# Altium project ESP32-Pico-Pill.PrjPcb
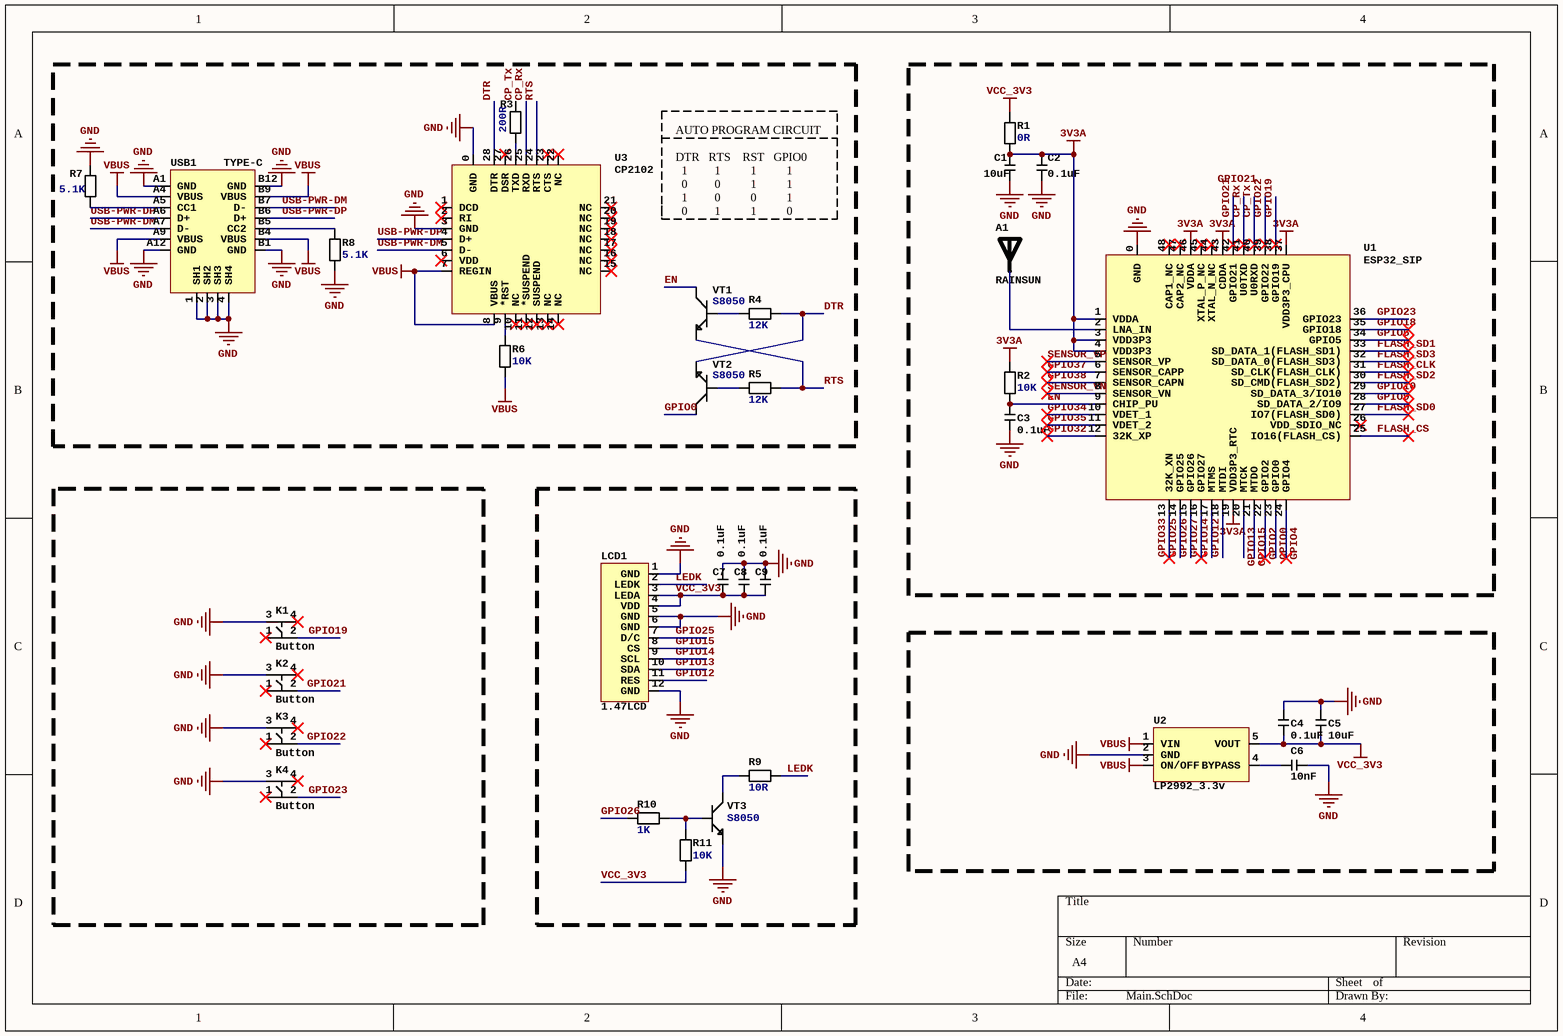
[diagram p0: Main.SchDoc]
1 sheet, 33 parts. Net scope: global (net labels, ports and power ports of the same name join across sheets).
Board file: ESP32-Pico-Pill.PcbDoc

## Sheet Main.SchDoc
size A4

### Parts
A1  RAINSUN  [ANT-Rainsun-AN5120]
C1  10uF  [CAP_0603]
C2  0.1uF  [CAP_0603]
C3  0.1uF  [CAP_0603]
C4  0.1uF  [CAP_0603]
C5  10uF  [CAP_0603]
C6  10nF  [CAP_0603]
C7  0.1uF  [CAP_0603]
C8  0.1uF  [CAP_0603]
C9  0.1uF  [CAP_0603]
K1  Button  [Button]
K2  Button  [Button]
K3  Button  [Button]
K4  Button  [Button]
LCD1  1.47LCD  [IPS130-12]
R1  0R  [RES_0603]
R2  10K  [RES_0603]
R3  200R  [RES_0603]
R4  12K  [RES_0603]
R5  12K  [RES_0603]
R6  10K  [RES_0603]
R7  5.1K  [RES_0603]
R8  5.1K  [RES_0603]
R9  10R  [RES_0603]
R10  1K  [RES_0603]
R11  10K  [RES_0603]
U1  ESP32_SIP  [ESP32-Pico]
U2  LP2992_3.3v  [LP2992]
U3  CP2102  [CP2102]
USB1  TYPE-C  [TYPE-C]
VT1  S8050  [s8050]
VT2  S8050  [s8050]
VT3  S8050  [s8050]

### Nets
3V3A: C1.2 C2.2 R1.1 R2.2 U1.1(VDDA) U1.3(VDD3P3) U1.4(VDD3P3) U1.19(VDD3P3_RTC) U1.37(VDD3P3_CPU) U1.43(CDDA) U1.46(VDDA)
GND: C1.1 C2.1 C3.1 C4.2 C5.2 C6.2 C7.2 C8.2 C9.2 K1.3 K2.3 K3.3 K4.3 LCD1.1(GND) LCD1.5(GND) LCD1.6(GND) LCD1.12(GND) R7.2 R8.1 U1.0(GND) U2.2(GND) U3.0(GND) U3.3(GND) USB1.1(SH1) USB1.2(SH2) USB1.3(SH3) USB1.4(SH4) USB1.A1(GND) USB1.A12(GND) USB1.B1(GND) USB1.B12(GND) VT3.2(E)
VBUS: R6.1 U2.1(VIN) U2.3(ON/OFF) U3.7(REGIN) U3.8(VBUS) USB1.A4(VBUS) USB1.A9(VBUS) USB1.B4(VBUS) USB1.B9(VBUS)
VCC_3V3: C4.1 C5.1 C7.1 C8.1 C9.1 LCD1.3(LEDA) LCD1.4(VDD) R1.2 R11.1 U2.5(VOUT)
CP_Rx: U1.41(U0TXD) U3.25(RXD)
CP_Tx: R3.2 U1.40(U0RXD)
DTR: R4.2 U3.28(DTR) VT2.2(E)
EN: C3.2 R2.1 U1.9(CHIP_PU) VT1.1(C)
FLASH_CLK: U1.31(SD_CLK(FLASH_CLK))
FLASH_CS: U1.25(IO16(FLASH_CS))
FLASH_SD0: U1.27(IO7(FLASH_SD0))
FLASH_SD1: U1.33(SD_DATA_1(FLASH_SD1))
FLASH_SD2: U1.30(SD_CMD(FLASH_SD2))
FLASH_SD3: U1.32(SD_DATA_0(FLASH_SD3))
GPIO0: U1.23(GPIO0) VT2.1(C)
GPIO2: U1.22(GPIO2)
GPIO4: U1.24(GPIO4)
GPIO5: U1.34(GPIO5)
GPIO9: U1.28(SD_DATA_2/IO9)
GPIO10: U1.29(SD_DATA_3/IO10)
GPIO12: LCD1.11(RES) U1.18(MTDI)
GPIO13: LCD1.10(SDA) U1.20(MTCK)
GPIO14: LCD1.9(SCL) U1.17(MTMS)
GPIO15: LCD1.8(CS) U1.21(MTDO)
GPIO18: U1.35(GPIO18)
GPIO19: K1.2 U1.38(GPIO19)
GPIO21: K2.2 U1.42(GPIO21)
GPIO22: K3.2 U1.39(GPIO22)
GPIO23: K4.2 U1.36(GPIO23)
GPIO25: LCD1.7(D/C) U1.14(GPIO25)
GPIO26: R10.1 U1.15(GPIO26)
GPIO27: U1.16(GPIO27)
GPIO32: U1.12(32K_XP)
GPIO33: U1.13(32K_XN)
GPIO34: U1.10(VDET_1)
GPIO35: U1.11(VDET_2)
GPIO37: U1.6(SENSOR_CAPP)
GPIO38: U1.7(SENSOR_CAPN)
LEDK: LCD1.2(LEDK) R9.2
RTS: R5.2 U3.24(RTS) VT1.2(E)
SENSOR_VN: U1.8(SENSOR_VN)
SENSOR_VP: U1.5(SENSOR_VP)
USB-PWR-DM: U3.5(D-) USB1.A7(D-) USB1.B7(D-)
USB-PWR-DP: U3.4(D+) USB1.A6(D+) USB1.B6(D+)
NetA1_1: A1.1 U1.2(LNA_IN)
NetC6_1: C6.1 U2.4(BYPASS)
NetR3_1: R3.1 U3.26(TXD)
NetR4_1: R4.1 VT1.3(B)
NetR5_1: R5.1 VT2.3(B)
NetR6_2: R6.2 U3.9(*RST)
NetR7_1: R7.1 USB1.A5(CC1)
NetR8_2: R8.2 USB1.B5(CC2)
NetR9_1: R9.1 VT3.1(C)
NetR10_2: R10.2 R11.2 VT3.3(B)

Not connected (* = marked no-connect by the designer): K1 1* 4*; K2 1* 4*; K3 1* 4*; K4 1* 4*; U1 26(VDD_SDIO_NC)* 44(XTAL_N_NC)* 45(XTAL_P_NC)* 47(CAP2_NC)* 48(CAP1_NC)*; U3 1(DCD)* 2(RI)* 6(VDD)* 10(NC)* 11(*SUSPEND)* 12(SUSPEND)* 13(NC)* 14(NC)* 15(NC)* 16(NC)* 17(NC)* 18(NC)* 19(NC)* 20(NC)* 21(NC)* 22(NC)* 23(CTS)* 27(DSR)*

### Notes on the sheet
- AUTO PROGRAM CIRCUIT
  DTR   RTS    RST   GPIO0
  1         1          1          1
  0         0          1          1
  1         0          0          1
  0         1          1          0
- Labels drawn without touching a wire or pin: GPIO21

### Library data of the parts
A1 = ANT-Rainsun-AP5120
C1 C5 = CAP_0603_10uF
C2-C4 C7-C9 = CAP_0603_0.1uF
C6 = CAP_0603_10nF
K1-K4 = Button: 中乌龟4.8x3.6x4.6mm
R1 = RES_0603_0R
R2 R6 R11 = RES_0603_10K
R3 = RES_0603_200R
R4 R5 = RES_0603_12K
R7 R8 = RES_0603_5.1K
R9 = RES_0603_10R
R10 = RES_0603_1K
U1 = ESP32-Pico-D4
USB1 = TYPE-C: TYPE-C  16P
VT1-VT3 = S8050: SOT23